# Altium project SAU-G0-EX_AHT-PL.PrjPcb
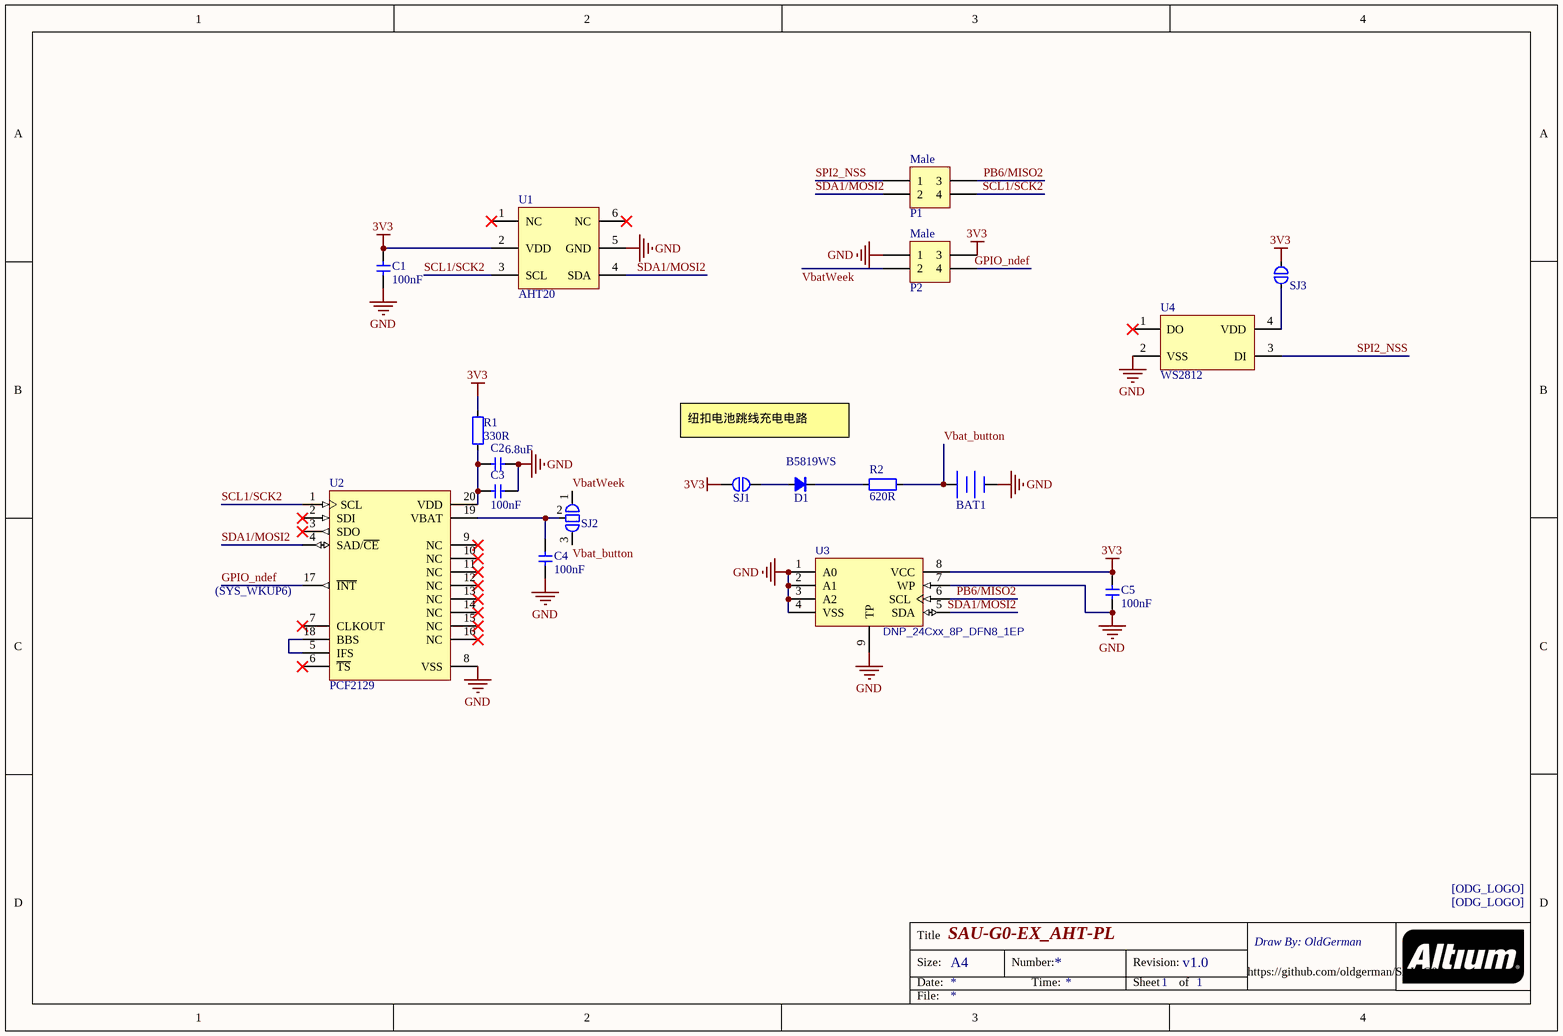
[diagram p0: SAU-G0-EX_AHT-PL.SchDoc]
1 sheet, 20 parts. Net scope: global (net labels, ports and power ports of the same name join across sheets).
Board file: SAU-G0-EX_AHT-PL.PcbDoc

## Sheet SAU-G0-EX_AHT-PL.SchDoc: SAU-G0-EX_AHT-PL
size A4; Address1: Draw By: OldGerman; Revision: v1.0; SheetNumber: 1; SheetTotal: 1

### Parts
BAT1  BAT  [MS621FE-FL11E]  (value not drawn)
C1  100nF  [C0402]
C2  6.8uF  [C0402]
C3  100nF  [C0402]
C4  100nF  [C0402]
C5  100nF  [C0402]
D1  B5819WS  [SOD-323]
ODG1  ODG_LOGO  [ODG_LOGO_soldermask]  (value not drawn)
ODG2  ODG_LOGO  [ODG_LOGO_soldermask]  (value not drawn)
P1  Male  [2.0mm_Male_2x2]
P2  Male  [2.0mm_Male_2x2]
R1  330R  [R0402]
R2  620R  [R0603]
SJ1  SJ_2P  [SJ_2P_MINI]  (value not drawn)
SJ2  SJ_3P  [SJ_3P_MINI]  (value not drawn)
SJ3  SJ_2P  [SJ_2P_MINI]  (value not drawn)
U1  AHT20  [AHT20]
U2  PCF2129  [NXP_SO20]
U3  DNP_24Cxx_8P_DFN8_1EP  [DFN-8-1EP_3x2mm_P0.5mm_EP1.75x1.45mm]
U4  WS2812  [WS2812_2020]

### Nets
3V3: C1.1 C5.1 P2.3 R1.2 SJ1.2 SJ3.1 U1.2(VDD) U3.8(VCC)
GND: BAT1.2(-) C1.2 C2.2 C3.2 C4.2 C5.2 P2.1 U1.5(GND) U2.8(VSS) U3.1(A0) U3.2(A1) U3.3(A2) U3.4(VSS) U3.7(WP) U3.9(TP) U4.2(VSS)
GPIO_ndef: P2.4 U2.17(~{INT})
PB6/MISO2: P1.3 U3.6(SCL)
SCL1/SCK2: P1.4 U1.3(SCL) U2.1(SCL)
SDA1/MOSI2: P1.2 U1.4(SDA) U2.4(SAD/~{CE}) U3.5(SDA)
SPI2_NSS: P1.1 U4.3(DI)
Vbat_button: BAT1.1(+) R2.2 SJ2.3
VbatWeek: P2.2 SJ2.1
NetC2_1: C2.1 C3.1 R1.1 U2.20(VDD)
NetC4_1: C4.1 SJ2.2 U2.19(VBAT)
NetD1_1: D1.1(A) SJ1.1
NetD1_2: D1.2(C) R2.1
NetSJ3_2: SJ3.2 U4.4(VDD)
NetU2_5: U2.5(IFS) U2.18(BBS)

Not connected (* = marked no-connect by the designer): U1 1(NC)* 6(NC)*; U2 2(SDI)* 3(SDO)* 6(~{TS})* 7(CLKOUT)* 9(NC)* 10(NC)* 11(NC)* 12(NC)* 13(NC)* 14(NC)* 15(NC)* 16(NC)*; U4 1(DO)*

### Notes on the sheet
- 纽扣电池跳线充电电路
- (near U2) (SYS_WKUP6)
- https://github.com/oldgerman/SAU-G0
- Title
- Size:
- Date:
- A4
- Number:
- Time:
- Revision:
- Sheet
- of
- File:
- (in symbol ODG_LOGO) [ODG_LOGO]

### Library data of the parts
BAT1 = BAT: 锂电池; Auther: JonesLee; Value: BAT; Publish: 11-4-2017
C1-C5 = CAP: Capacitor; Value: 0.1u
D1 = DIODE: 二极管
P1 P2 = CONN_2X2
R1 R2 = RES: Resistor; Value: 22R
SJ1 SJ3 = SJ_2P: 焊接跳线
SJ2 = SJ_3P: 焊接跳线二选一
U1 = AHT20: 线性稳压芯片; BOM名称: 可调升压芯片; 版权归属: 源创客; 学习资源: www.ooocke.com
U2 = PCF2129: RTC
U3 = 24Cxx_8P_DFN8_1EP